# EAGLE design LightingUPS_v2 (EAGLE 7.5.0)
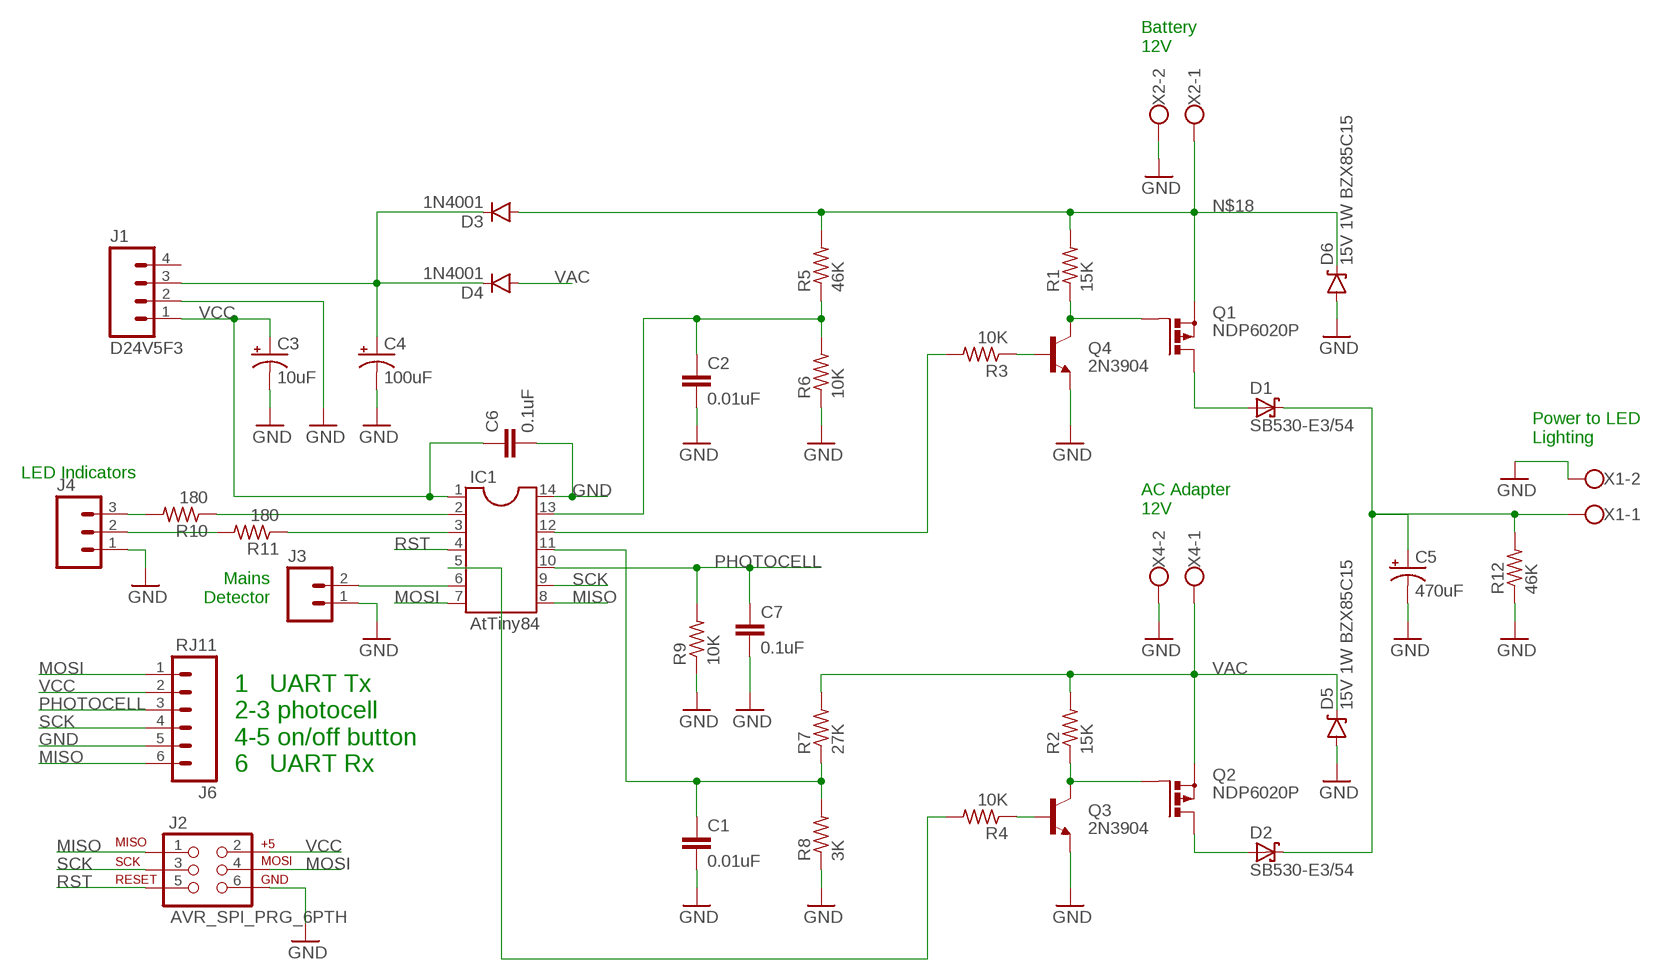
[diagram p0: schematic, sheet 1]

## Parts
C1  0.01uF  CAPPTH1  [CAP-PTH-5MM]
C2  0.01uF  CAPPTH1  [CAP-PTH-5MM]
C3  10uF  CAP_POLPTH1  [CPOL-RADIAL-100UF-25V]
C4  100uF  CAP_POLPTH1  [CPOL-RADIAL-100UF-25V]
C5  470uF  CAP_POLPTH4  [CPOL-RADIAL-1000UF-25V]
C6  0.1uF  CAPPTH  [CAP-PTH-SMALL]
C7  0.1uF  CAPPTH  [CAP-PTH-SMALL]
D1  SB530-E3/54  SCHOTTKY-DIODEDO201T15  [DO201T15]
D2  SB530-E3/54  SCHOTTKY-DIODEDO201T15  [DO201T15]
D3  1N4001  DIODEPTH  [DIODE-1N4001]
D4  1N4001  DIODEPTH  [DIODE-1N4001]
D5  15V 1W BZX85C15  DIODE-ZENERPTH  [DIODE-ZENER]
D6  15V 1W BZX85C15  DIODE-ZENERPTH  [DIODE-ZENER]
IC1  AtTiny84  DIL14  [DIL14]
J1  D24V5F3  M04PTH  [1X04]
J2  AVR_SPI_PRG_6PTH  [2X3]
J3  M02PTH  [1X02]
J4  M03PTH  [1X03]
J6  RJ11  RJ11-6PTH  [RJ11-6]
Q1  NDP6020P  PMOSFET_PTO220BV  [TO220BV]
Q2  NDP6020P  PMOSFET_PTO220BV  [TO220BV]
Q3  2N3904  TRANSISTOR_NPNTO-92-AMMO  [TO-92-AMMO]
Q4  2N3904  TRANSISTOR_NPNTO-92-AMMO  [TO-92-AMMO]
R1  15K  R-US_0204/5  [0204/5]
R2  15K  R-US_0204/5  [0204/5]
R3  10K  R-US_0204/5  [0204/5]
R4  10K  R-US_0204/5  [0204/5]
R5  46K  R-US_0204/5  [0204/5]
R6  10K  R-US_0204/5  [0204/5]
R7  27K  R-US_0204/5  [0204/5]
R8  3K  R-US_0204/5  [0204/5]
R9  10K  R-US_0204/5  [0204/5]
R10  180  R-US_0204/5  [0204/5]
R11  180  R-US_0204/5  [0204/5]
R12  46K  R-US_0204/5  [0204/5]
X1  W237-102  [W237-102]
X2  W237-102  [W237-102]
X4  W237-102  [W237-102]

## Nets
GND: C1.2 C2.2 C3.2(-) C4.2(-) C5.- C6.2 C7.2 D5.P$2(A) D6.P$2(A) IC1.14 J1.2 J2.6 J3.1 J4.1 J6.5 Q3.1(E) Q4.1(E) R6.1 R8.1 R9.1 R12.1 X1.2 X2.2 X4.2
MISO: IC1.8 J2.1 J6.6
MOSI: IC1.7 J2.4 J6.1
N$1: J4.3 R10.2
N$2: Q1.G Q4.3(C) R1.1
N$3: Q4.2(B) R3.1
N$4: D1.A Q1.D
N$5: C5.+ D1.C D2.C R12.2 X1.1
N$6: C2.1 IC1.13 R5.1 R6.2
N$7: IC1.6 J3.2
N$8: C1.1 IC1.11 R7.1 R8.2
N$9: Q2.G Q3.3(C) R2.1
N$10: Q3.2(B) R4.1
N$11: D2.A Q2.D
N$12: IC1.12 R3.2
N$13: C4.1(+) D3.C D4.C J1.3
N$14: IC1.5 R4.2
N$15: IC1.2 R10.1
N$16: IC1.3 R11.1
N$17: J4.2 R11.2
N$18: D3.A D6.P$1(C) Q1.S R1.2 R5.2 X2.1
PHOTOCELL: C7.1 IC1.10 J6.3 R9.2
RST: IC1.4 J2.5
SCK: IC1.9 J2.3 J6.4
VAC: D4.A D5.P$1(C) Q2.S R2.2 R7.2 X4.1
VCC: C3.1(+) C6.1 IC1.1 J1.1 J2.2 J6.2
Unconnected: J1.4

## Notes on the sheet
- Battery
  12V
- Power to LED
  Lighting
- LED Indicators
- AC Adapter
  12V
- Mains
  Detector
- 1   UART Tx
  2-3 photocell
  4-5 on/off button
  6   UART Rx

## Library data of the parts
C1 C2 = SparkFun-Passives:CAP: Capacitor Standard 0603 ceramic capacitor, and 0.1" leaded capacitor.
C3-C5 = SparkFun-Capacitors:CAP_POL: Capacitor Polarized These are standard SMD and PTH capacitors. Normally 10uF, 47uF, and 100uF in electrolytic and tantalum varieties. Always verify the external diameter of the through hole cap, it varies with capacity, voltage, and manufacturer. The EIA devices should be standard.
C6 C7 = SparkFun-Capacitors:CAP: Capacitor Standard 0603 ceramic capacitor, and 0.1" leaded capacitor.
D1 D2 = adafruit:SCHOTTKY-DIODE: Schottky Diode
D3 D4 = SparkFun-DiscreteSemi:DIODE: Diode These are standard reverse protection diodes and small signal diodes. SMA package can handle up to about 1A. SOD-323 can handle about 200mA. What the SOD-323 package when ordering, there are some mfgs out there that are 5-pin packages.
D5 D6 = SparkFun-DiscreteSemi:DIODE-ZENER: Zener Diode Production Part - 8199 3.4V Zener Voltage
IC1 = ic-package:DIL14: Dual In Line / Socket
J1 = SparkFun-Connectors:M04: Header 4 Standard 4-pin 0.1" header. Use with straight break away headers (SKU : PRT-00116), right angle break away headers (PRT-00553), swiss pins (PRT-00743), machine pins (PRT-00117), and female headers (PRT-00115). Molex polarized connector foot print use with SKU : PRT-08231 with associated crimp pins and housings. 1MM SMD Version SKU: PRT-10208; PROD_ID: CONN-09696
J2 = SparkFun-Connectors:AVR_SPI_PRG_6: AVR ISP 6 Pin This is the reduced ISP connector for AVR programming. Common on Arduino. This footprint will take up less PCB space and can be used with a 10-pin to 6-pin adapter such as SKU: BOB-08508 **Special note about "TEST_POINT" package. The stop mask is on the top side, so if you want your programming test points to be on the bottom of your board, make sure to place this package on the bottom side of the board. This also ensure that the orientation to program from the bottom side will be correct.
J3 = SparkFun-Connectors:M02: Standard 2-pin 0.1" header. Use with - straight break away headers ( PRT-00116) - right angle break away headers (PRT-00553) - swiss pins (PRT-00743) - machine pins (PRT-00117) - female headers (PRT-00115) Molex polarized connector foot print use with: PRT-08233 with associated crimp pins and housings. 2.54_SCREWTERM for use with PRT-10571. 3.5mm Screw Terminal footprints for PRT-08084 5mm Screw Terminal footprints for use with PRT-08432
J4 = SparkFun-Connectors:M03: Header 3 Standard 3-pin 0.1" header. Use with straight break away headers (SKU : PRT-00116), right angle break away headers (PRT-00553), swiss pins (PRT-00743), machine pins (PRT-00117), and female headers (PRT-00115). Molex polarized connector foot print use with SKU : PRT-08232 with associated crimp pins and housings.
J6 = SparkFun-Connectors:RJ11-6: RJ11 Jack Simple 6 pin RJ11 jack. Commonly found on CAT3 devices and Microchip programmers. SKU: PRT-00132; PROD_ID: CONN-08590
Q1 Q2 = transistor-power:PMOSFET_P: Power MOSFET P-Channel
Q3 Q4 = SparkFun-DiscreteSemi:TRANSISTOR_NPN: Generic NPN BJT MMBT2222A - TRANS-08049 (SOT-23, 1A 40V) MPSA42 - TRANS-09116 (SOT-23, 500mA 300V) MMBT5088LT1G - TRANS-11160 (SOT-23, 50 mA 30V) BC547 - COM-08928 <http://www.sparkfun.com/products/8928> (TO-92 45V 100mA) (1.Collector 2.Base 3.Emitter) 2N3904 - COM-00521 <http://www.sparkfun.com/products/521> (TO-92 40V 200mA) (1.Emitter 2.Base 3.Collector) P2N2222A - COM-12852 <http://www.sparkfun.com/products/12852> (TO-92 40V 600mA) (1.Collector 2.Base 3.Emitter)
R1-R12 = resistor:R-US_: RESISTOR, American symbol
X1 X2 X4 = con-wago-500:W237-102: WAGO SCREW CLAMP; MPN: 237-102; OC_FARNELL: unknown; OC_NEWARK: 70K9898

## Board
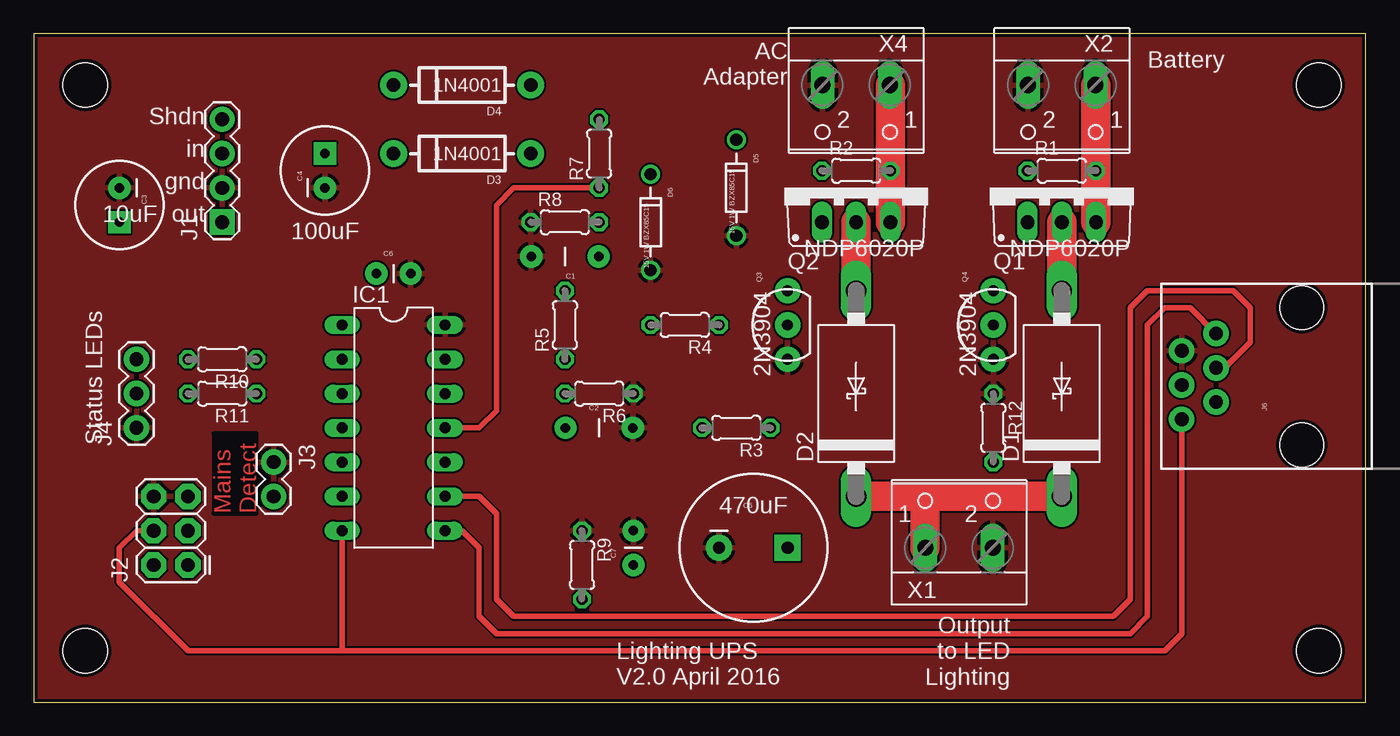
[diagram p1: board, top side]
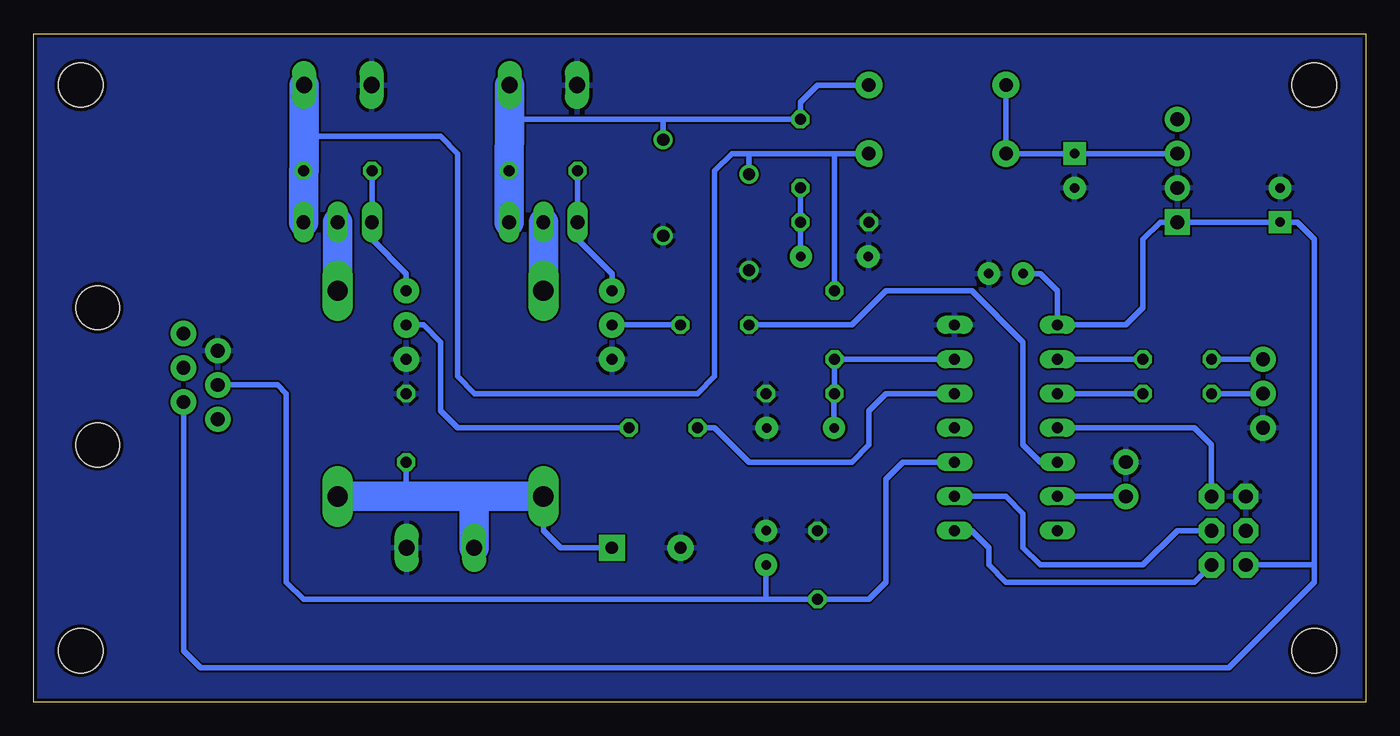
[diagram p2: board, bottom side, seen from below]

Size 98.73 x 49.52 mm. Coordinates in mm from the lower left corner, seen from the top.
Outline: 0,0 98.73,0 98.73,49.52 0,49.52 0,0
Copper layers (1*16): Top 0.035mm / dielectric 1.5mm / Bottom 0.035mm
Design rules "SeeedStudio_2layer_DRU_no_angle_20140221": minimum track width 6mil, minimum drill 12mil, track to track 6mil, track to pad 6mil, pad to pad 6mil, via to via 6mil, smd to smd 0mil, copper to edge 10mil, drill to drill 10mil, minimum pad ring 10mil, minimum via ring 6mil, stop-mask expansion 2mil, vias tented up to drill 100mil, thermal gap 10mil

### Footprints (pad centres in the part's own frame; a part is rotated, then mirrored left to right if it is on the bottom)
CAP-PTH-5MM = drill 0.7 pad 1.651: 1 -2.5,0; 2 2.5,0
CPOL-RADIAL-100UF-25V = drill 0.7 pad 1.651 square: 1 1.27,0 | drill 0.7 pad 1.651: 2 -1.27,0
CPOL-RADIAL-1000UF-25V = drill 0.9 pad 1.93 square: + 2.54,0 | drill 0.9 pad 1.93: - -2.54,0
CAP-PTH-SMALL = drill 0.7 pad 1.651: 1 0,0; 2 2.54,0
DO201T15 = drill 1.499 long: A 7.62,0; C -7.62,0
DIODE-1N4001 = drill 1 pad 1.981: A -5.08,0; C 5.08,0
DIODE-ZENER = drill 0.9: P$1 -3.556,0; P$2 3.556,0
DIL14 = drill 0.813 long: 1 -7.62,-3.81; 2 -5.08,-3.81; 3 -2.54,-3.81; 4 0,-3.81; 5 2.54,-3.81; 6 5.08,-3.81; 7 7.62,-3.81; 8 7.62,3.81; 9 5.08,3.81; 10 2.54,3.81; 11 0,3.81; 12 -2.54,3.81; 13 -5.08,3.81; 14 -7.62,3.81
1X04 = drill 1.016 pad 1.88 square: 1 0,0 | drill 1.016 pad 1.88: 2 2.54,0; 3 5.08,0; 4 7.62,0
2X3 = drill 1.016 pad 1.88 octagon: 1 0,0; 2 0,2.54; 3 2.54,0; 4 2.54,2.54; 5 5.08,0; 6 5.08,2.54
1X02 = drill 1.016 pad 1.88: 1 0,0; 2 2.54,0
1X03 = drill 1.016 pad 1.88: 1 0,0; 2 2.54,0; 3 5.08,0
RJ11-6 = drill 1.016 pad 1.88: 1 -3.175,8.89; 2 -1.905,6.35; 3 -0.635,8.89; 4 0.635,6.35; 5 1.905,8.89; 6 3.175,6.35 | hole 3.251: -5.08,0; 5.08,0
TO220BV = drill 1.016 long: D 0,-2.54; G -2.54,-2.54; S 2.54,-2.54
TO-92-AMMO = drill 0.813 pad 1.88: 1 -2.54,0; 2 0,0; 3 2.54,0
0204/5 = drill 0.813 octagon: 1 -2.54,0; 2 2.54,0
STAND-OFF = hole 3.302: 0,0
W237-102 = drill 1.194 long: 1 -2.5,-1.27; 2 2.5,-1.27

### Placement (x,y rotation side)
C1  39.37,33.02 180 top
C2  41.91,20.32 0 top
C3  6.35,36.83 270 top
C4  21.59,39.37 90 top
C5  53.34,11.43 0 top
C6  25.4,31.75 0 top
C7  44.45,10.16 90 top
D1  76.2,22.86 90 top
D2  60.96,22.86 90 top
D3  31.75,40.64 180 top
D4  31.75,45.72 180 top
D5  52.07,38.1 270 top
D6  45.72,35.56 270 top
IC1  26.67,20.32 270 top
J1  13.97,35.56 90 top
J2  11.43,10.16 90 top
J3  17.78,17.78 270 top
J4  7.62,20.32 90 top
J6  93.98,24.13 90 top
Q1  76.2,38.1 0 top
Q2  60.96,38.1 0 top
Q3  55.88,27.94 90 top
Q4  71.12,27.94 90 top
R1  76.2,39.37 0 top
R2  60.96,39.37 0 top
R3  52.07,20.32 180 top
R4  48.26,27.94 180 top
R5  39.37,27.94 90 top
R6  41.91,22.86 180 top
R7  41.91,40.64 90 top
R8  39.37,35.56 0 top
R9  40.64,10.16 270 top
R10  13.97,25.4 180 top
R11  13.97,22.86 180 top
R12  71.12,20.32 270 top
U$1  [STAND-OFF]  3.81,3.81 0 top
U$2  [STAND-OFF]  95.25,3.81 0 top
U$3  [STAND-OFF]  3.81,45.72 0 top
U$4  [STAND-OFF]  95.25,45.72 0 top
X1  68.58,12.7 0 top
X2  76.2,44.45 180 top
X4  60.96,44.45 180 top

### Tracks (layer width: path | path; a pad name or v marks a point on that pad's centre or on a via)
GND
  pour Bottom: 0,0 0,49.53 99.06,49.53 99.06,0
  pour Top: 0,0 0,49.53 99.06,49.53 99.06,0
MISO
  Top 0.406: IC1.8 31.75,12.7 33.02,11.43 33.02,6.35 34.29,5.08 81.28,5.08 82.55,6.35 82.55,27.94 83.82,29.21 85.72,29.21 J6.6
  Bottom 0.406: IC1.8 29.21,12.7 27.94,11.43 27.94,10.16 26.67,8.89 12.7,8.89 J2.1
MOSI
  Top 0.406: 22.86,3.81 83.82,3.81 85.09,5.08 J6.1 | IC1.7 22.86,3.81 | 22.86,3.81 11.43,3.81 6.35,8.89 6.35,11.43 7.62,12.7 J2.4
N$1
  Bottom 0.406: J4.3 R10.2
N$2
  Bottom 0.406: Q4.3 71.12,31.75 73.66,34.29 Q1.G R1.1
N$3
  Bottom 0.406: R3.1 67.31,20.32 68.58,21.59 68.58,26.67 69.85,27.94 Q4.2
N$4
  Top 2.184: Q1.D D1.A
  Bottom 2.184: D1.A Q1.D
N$5
  Top 2.184: D2.C 66.04,15.24 | 66.04,15.24 D1.C | 66.04,11.43 66.04,15.24
  Bottom 0.406: C5.+ 59.69,11.43 60.96,12.7 D2.C | R12.2 71.12,15.24
  Bottom 2.184: D2.C 66.04,15.24 | 66.04,15.24 71.12,15.24 D1.C | X1.1 66.08,15.2 66.04,15.24
N$6
  Bottom 0.406: IC1.13 R5.1 R6.2 39.41,22.86 C2.1
N$7
  Bottom 0.406: IC1.6 J3.2
N$8
  Top 0.406: IC1.11 33.02,20.32 34.29,21.59 34.29,36.83 35.56,38.1 R7.1
  Bottom 0.406: R7.1 R8.2 41.91,33.12 arc-45 C1.1 arc-45 41.91,32.92
N$9
  Bottom 0.406: Q3.3 55.88,31.75 58.42,34.29 Q2.G R2.1
N$10
  Bottom 0.406: R4.1 Q3.2
N$11
  Top 2.184: Q2.D D2.A
  Bottom 2.184: Q2.D D2.A
N$12
  Bottom 0.406: IC1.12 35.56,22.86 36.83,21.59 36.83,19.05 38.1,17.78 45.72,17.78 48.26,20.32 R3.2
N$13
  Bottom 0.406: J1.3 C4.1 D3.C D4.C
N$14
  Bottom 0.406: R4.2 38.1,27.94 35.56,30.48 29.21,30.48 25.4,26.67 25.4,19.05 24.13,17.78 IC1.5
N$15
  Bottom 0.406: IC1.2 R10.1
N$16
  Bottom 0.406: IC1.3 R11.1
N$17
  Bottom 0.406: J4.2 R11.2
N$18
  Top 2.184: 78.74,45.72 Q1.S
  Bottom 0.406: D3.A 39.37,40.64 | 39.37,40.64 45.72,40.64 | 45.72,40.64 46.99,40.64 48.26,39.37 48.26,24.13 49.53,22.86 66.04,22.86 67.31,24.13 67.31,40.64 68.58,41.91 78.7,41.91 | R5.2 39.37,40.64 | D6.P$1 45.72,40.64
  Bottom 2.184: Q1.S R1.2 78.7,39.41 78.7,41.91 X2.1
PHOTOCELL
  Bottom 0.406: J6.3 80.64,23.5 80.01,22.86 80.01,8.89 78.74,7.62 44.45,7.62 | IC1.10 34.29,17.78 35.56,16.51 35.56,8.89 36.83,7.62 R9.2 44.45,7.62 | C7.1 44.45,7.62
RST
  Bottom 0.406: IC1.4 12.7,20.32 11.43,19.05 J2.5
SCK
  Top 0.406: IC1.9 33.02,15.24 34.29,13.97 34.29,7.62 35.56,6.35 80.01,6.35 81.28,7.62 81.28,29.21 82.55,30.48 88.9,30.48 90.17,29.21 90.17,26.67 88.27,24.77 J6.4
  Bottom 0.406: IC1.9 26.67,15.24 25.4,13.97 25.4,11.43 24.13,10.16 16.51,10.16 13.97,12.7 J2.3
VAC
  Top 2.184: Q2.S 63.5,45.72
  Bottom 0.406: D4.A 40.64,45.72 41.91,44.45 R7.2 52.07,43.18 | 52.07,43.18 63.48,43.19 | D5.P$1 52.07,43.18
  Bottom 2.184: Q2.S R2.2 63.48,43.19 X4.1
VCC
  Bottom 0.406: 3.81,10.16 3.81,34.29 5.08,35.56 C3.1 J1.1 15.24,35.56 16.51,34.29 16.51,29.21 17.78,27.94 IC1.1 22.86,30.48 24.13,31.75 C6.1 | J6.2 87.63,3.81 86.36,2.54 10.16,2.54 3.81,8.89 3.81,10.16 | J2.2 3.81,10.16

### Text on the board
Top: Mains / Detect
tPlace: Battery | AC / Adapter | 10uF | Shdn / in / gnd / out | 100uF | NDP6020P | NDP6020P | 2N3904 | 2N3904 | Status LEDs | 470uF | Lighting UPS / V2.0 April 2016 | Output / to LED / Lighting